# EasyEDA Pro project ExtBoard-001_2024-04-03.epro, board PCB-ExtBoard-001
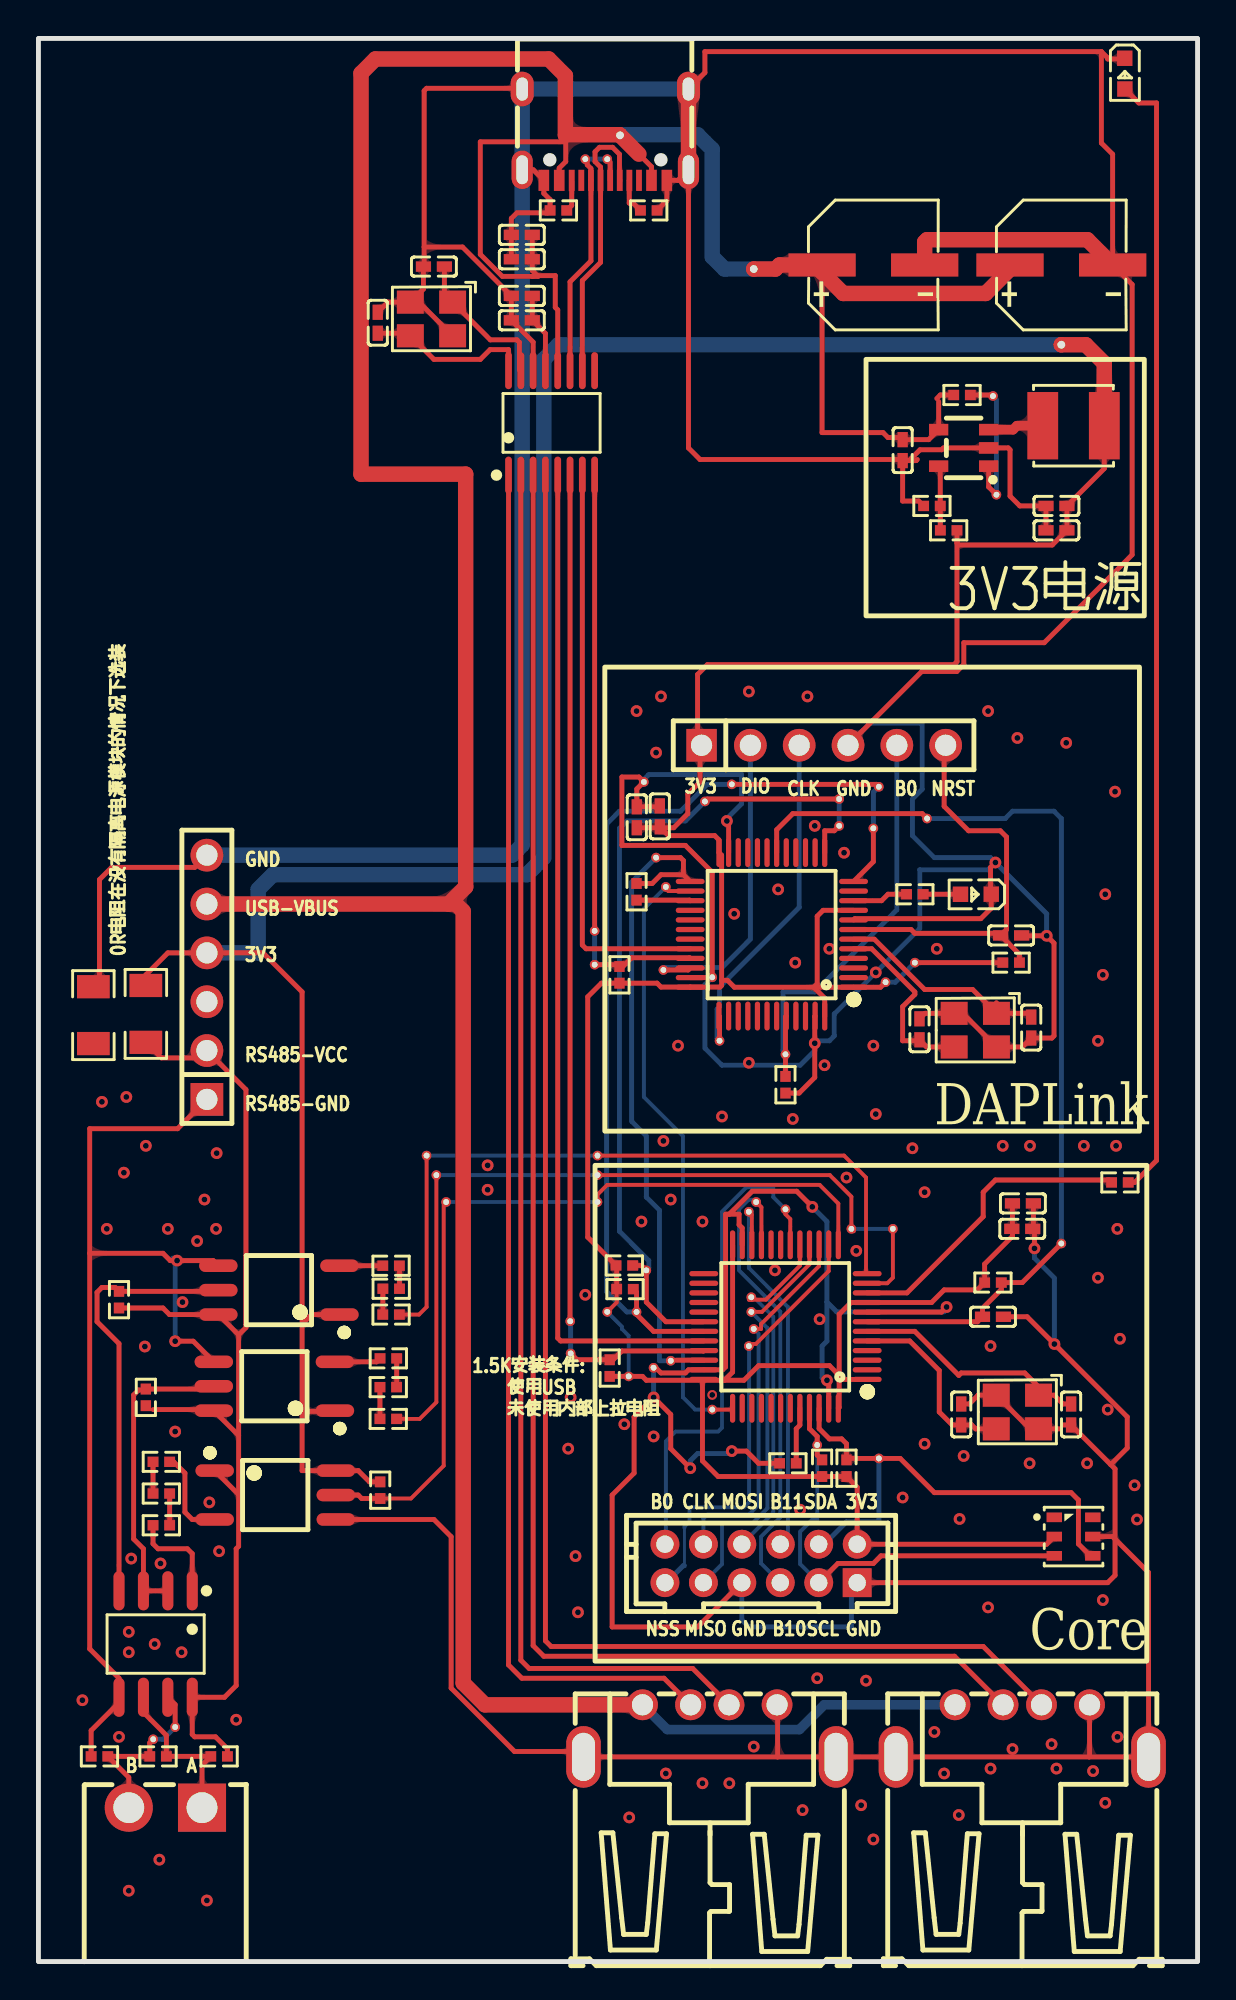
[diagram p5: board, top side]
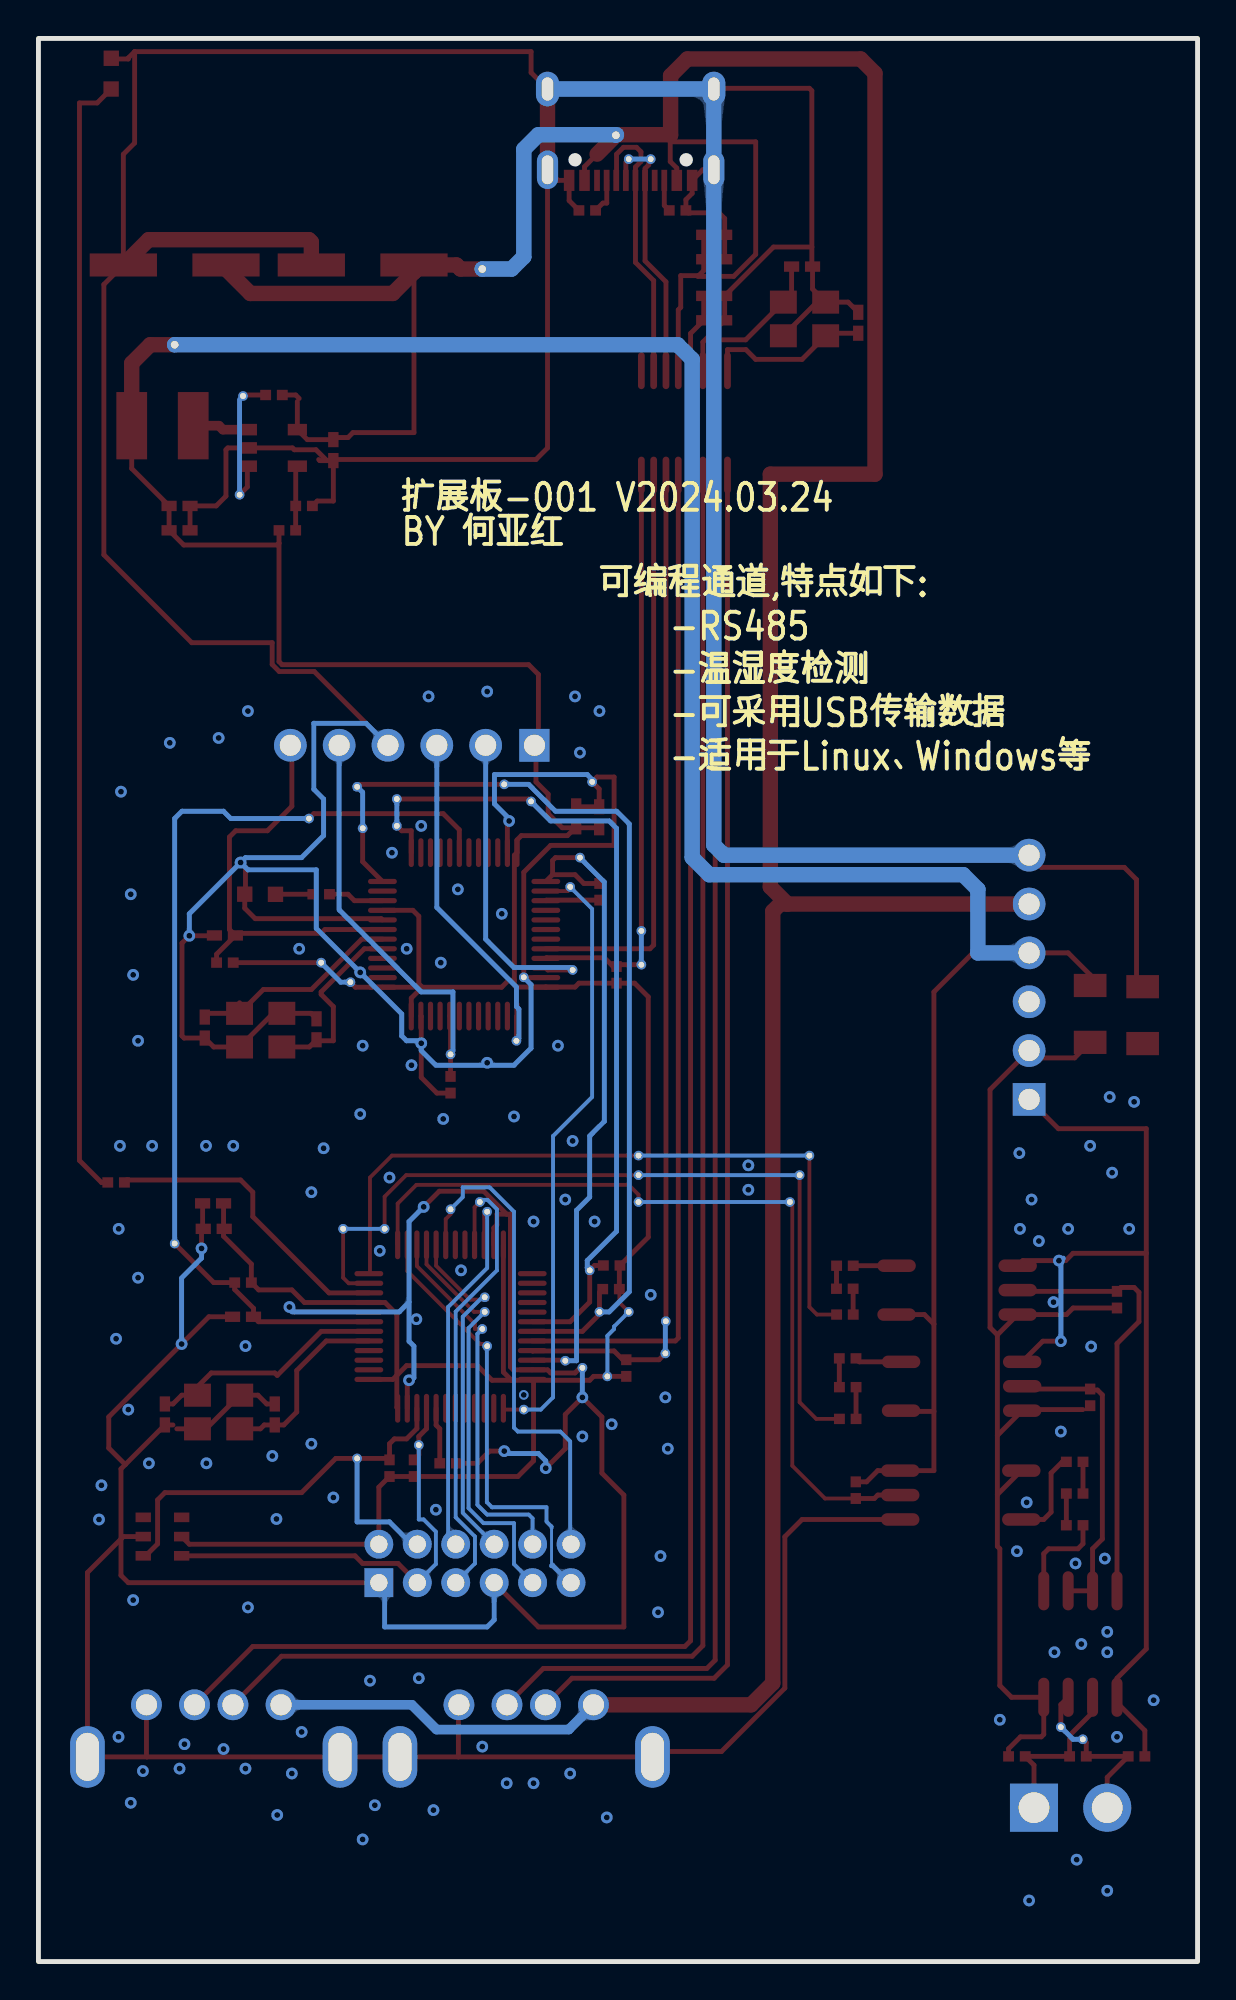
[diagram p6: board, bottom side, seen from below]

Outline 60.3 x 100 mm; copper layers: Top Layer, Bottom Layer. Coordinates in mm from the lower left corner of the outline.
Outline path: rectangle 0,100 60.3,0
Stack: Top Layer 0.035mm / Dielectric1 1.51mm FR4 er 4.5 / Bottom Layer 0.035mm

## Design rules (mm)
net DM4: USB4
net DP4: USB4
net DM3: USB3
net DP3: USB3
net DM2: USB2
net DP2: USB2
net DM1: USB1
net DP1: USB1
net DP-UP: USB-UP
net DM-UP: USB-UP
template: 自定义配置
spacing copperThickness1oz (default): track to track 0.102, other pairs 0.102 to 0.3
spacing copperThickness2oz: track to track 0.203, other pairs 0.152 to 0.3
track width copperThickness1oz (default): min 0.127, default 0.254, max 2.54
track width copperThickness2oz: min 0.203, default 0.254, max 2.54
track width VBUS: min 0.254, default 0.4, max 2.54
differential pair differentialPair (default): width min 0.127, default 0.254, max 2.54; gap min 0.152, default 0.152
via viaSize (default): diameter min 0.5, default 0.61, max 10; hole min 0.3, default 0.305, max 6.3
net USB-VBUS uses VBUS

## Placement (name value [footprint] x y rotation side)
C1  10uF  [C0402]  51.18 38.1 180 top
C2  100nF  [C0402]  51.22 39.42 180 top
C3  100nF  [C0402]  25.15 85.34 0 top
C4  10uF  [C0402]  25.15 86.61 0 top
C5  10uF  [C0402]  25.15 89.79 0 top
C6  100nF  [C0402]  25.15 88.52 0 top
C7  20pF  [C0402]  17.65 85.22 270 top
C8  20pF  [C0402]  20.57 88.14 180 top
C9  12pF  [C0402]  48.01 28.45 270 top
C10  12pF  [C0402]  53.72 28.45 90 top
C11  100nF  [C0402]  49.66 33.53 180 top
C15  10uF  [C0402]  44.96 78.59 90 top
C16  10uF  [C0402]  52.96 75.69 0 top
C17  100nF  [C0402]  52.96 74.42 0 top
C22  100uF  [CAP-SMD_BD6.3-L6.6-W6.6-FD]  53.21 88.22 0 top
C23  100uF  [CAP-SMD_BD6.3-L6.6-W6.6-FD]  43.43 88.22 0 top
C24  100nF  [C0402]  50.6 53.36 180 top
C25  12pF  [C0402]  45.83 48.48 270 top
C26  12pF  [C0402]  51.65 48.57 90 top
C30  10uF  [C0402]  31.13 59.5 270 top
C31  100nF  [C0402]  32.32 59.55 270 top
CN1  DB2ERC-3.81-2P-GN  [CONN-TH_2P-P3.81_DB2ERC-3.81-2P]  6.6 8 0 top
CN2  顶板接口  [CONN-TH_12P-P2.00_HCTL_HC-PHD]  37.59 20.7 0 top
H1  PZ254-1-06-Z-8.5  [HDR-TH_06P-P2.54-V-M]  40.85 63.25 0 top
H2  PZ254V-11-06P  [HDR-TH_6P-P2.54-V-M]  8.76 51.18 90 top
L1  4.7uH  [IND-SMD_L4.0-W4.0]  53.85 79.86 0 top
LED1  NCD0603R1  [LED0603-RD_RED]  48.77 55.5 180 top
LED2  Run LED  [LED0603-RD_RED]  56.52 98.17 270 top
NOREF  -  [Pad_e43]  27.66 33.3 0 top
NOREF#2  -  [Pad_e875]  53.21 37.34 0 top
NOREF#3  -  [Pad_e1357]  36.96 38.99 0 top
NOREF#4  -  [Pad_e12496]  28.93 51.84 0 top
NOREF#5  -  [Pad_e570]  44.07 50.93 0 top
NOREF#6  -  [Pad_e888]  46.23 59.44 0 top
NOREF#7  -  [Pad_e569]  45.59 51.94 0 top
NOREF#8  -  [Pad_e1147]  20.19 41.91 0 top
NOREF#9  -  [Pad_e607]  5.97 11.56 0 top
NOREF#10  -  [Pad_e12577]  49.84 76.27 0 top
NOREF#11  -  [Pad_e12503]  53.21 84.07 0 top
NOREF#12  -  [Pad_e1473]  37.08 33.78 0 top
NOREF#13  -  [Pad_e12494]  29.59 93.73 0 top
NOREF#14  -  [Pad_e1303]  35.05 28.7 0 top
NOREF#15  -  [Pad_e1075]  43.72 26.16 0 top
NOREF#16  -  [Pad_e12495]  28.93 53.59 0 top
NOREF#17  -  [Pad_e506]  32.51 51.56 0 top
NOREF#18  -  [Pad_e1158]  29.08 41.91 0 top
NOREF#19  -  [Pad_e1472]  37.08 34.54 0 top
NOREF#20  -  [Pad_e1088]  40.51 26.86 0 top
NOREF#21  -  [Pad_e918]  41.66 60.45 0 top
NOREF#22  -  [Pad_e1154]  21.21 39.5 0 top
NOREF#23  -  [Pad_e919]  43.72 61.09 0 top
NOREF#24  -  [Pad_e1236]  32.64 55.88 0 top
NOREF#25  -  [Pad_e896]  41.66 59.06 0 top
NOREF#26  -  [Pad_e1739]  32 30.88 0 top
NOREF#27  -  [Pad_e1904]  35.05 51.18 0 top
NOREF#28  -  [Pad_e941]  36.07 61.21 0 top
NOREF#29  -  [Pad_e507]  35.43 47.88 0 top
NOREF#30  -  [Pad_e1637]  36.96 32 0 top
NOREF#31  -  [Pad_e1221]  42.29 38.1 0 top
NOREF#32  -  [Pad_e908]  43.43 58.93 0 top
NOREF#33  -  [Pad_e508]  38.86 47.17 0 top
NOREF#34  -  [Pad_e1886]  31.5 61.34 0 top
NOREF#35  -  [Pad_e12492]  28.45 93.73 0 top
NOREF#36  -  [Pad_e1474]  37.21 32.89 0 top
NOREF#37  -  [Pad_e954]  31.62 35.94 0 top
NOREF#38  -  [Pad_e12500]  30.26 94.96 0 top
NOREF#39  -  [Pad_e1378]  37.34 39.5 0 top
NOREF#40  -  [Pad_e1153]  20.7 40.89 0 top
NOREF#41  -  [Pad_e1160]  29.08 39.5 0 top
NOREF#42  -  [Pad_e1266]  32.13 57.4 0 top
NOREF#43  -  [Pad_e1410]  38.86 39.12 0 top
NOREF#44  -  [Pad_e12501]  37.21 88.01 0 top
NOREF#45  -  [Pad_e608]  7.11 12.19 0 top
NOREF#46  -  [Pad_e1225]  44.45 38.1 0 top
NOREF#47  -  [Pad_e49]  27.69 31.62 0 top
NOREF#48  -  [Pad_e1292]  32.89 31.24 0 top
NOREF#49  -  [Pad_e1159]  29.08 40.89 0 top
NOREF#50  -  [Pad_e12570]  49.66 81.41 0 top
NOREF#51  -  [Pad_e1313]  30.7 30.43 0 top
NOREF#52  -  [Pad_e942]  34.67 60.33 0 top
NOREF#53  -  [Pad_e1323]  29.59 33.78 0 top
NOREF#54  -  [Pad_e969]  31.11 33.78 0 top
R1  5.1kΩ  [R0402]  27.05 91.06 180 top
R2  5.1kΩ  [R0402]  31.75 91.06 0 top
R3  10kΩ  [R0402]  38.99 25.91 180 top
R4  10kΩ  [R0402]  50.6 51.94 180 top
R6  1.5kΩ  [R0402]  29.72 30.86 270 top
R7  10kΩ  [R0402]  30.51 34.97 0 top
R8  10kΩ  [R0402]  30.48 36.2 0 top
R11  1kΩ  [R0402]  48.05 81.46 180 top
R12  68kΩ  [R0402]  47.35 74.42 180 top
R13  15kΩ  [R0402]  46.48 75.69 180 top
R14  10kΩ  [R0402]  38.86 45.59 270 top
R15  1.5kΩ  [R0402]  30.23 51.31 270 top
R16  100Ω  [R0402]  31.11 55.63 270 top
R17  5.1kΩ  [R0402]  45.59 55.5 180 top
R18  5.1kΩ  [R0402]  56.26 40.51 180 top
R19  1.5kΩ  [R0402]  6.22 10.67 0 top
R20  10kΩ  [R0402]  9.4 10.67 0 top
R21  10kΩ  [R0402]  3.18 10.67 0 top
R22  1.5kΩ  [R0402]  5.59 29.34 270 top
R23  1.5kΩ  [R0402]  4.19 34.42 270 top
R24  1.5kΩ  [R0402]  17.78 24.51 270 top
R25  100Ω  [R0402]  6.39 25.99 0 top
R26  100Ω  [R0402]  6.39 24.34 0 top
R27  100Ω  [R0402]  6.39 22.69 0 top
R28  100Ω  [R0402]  18.35 33.64 0 top
R29  100Ω  [R0402]  18.35 34.99 0 top
R30  100Ω  [R0402]  18.35 36.18 0 top
R31  100Ω  [R0402]  18.2 28.22 0 top
R32  100Ω  [R0402]  18.2 29.87 0 top
R33  100Ω  [R0402]  18.2 31.36 0 top
R34  0Ω  [R1206]  2.86 49.21 90 top
R35  0Ω  [R1206]  5.59 49.28 270 top
R36  68kΩ  [R0402]  49.66 35.31 180 top
R37  10kΩ  [R0402]  40.77 25.65 270 top
R38  10kΩ  [R0402]  42.04 25.65 270 top
U1  CH334R  [QSOP-16_L4.9-W3.9-P0.64-LS6.0-BL]  26.69 80.01 0 top
U2  AIR32F103CCT6-LQFP48  [LQFP-48_L7.0-W7.0-P0.50-LS9.0-BL]  38.86 33.02 90 top
U3  SY8089AAAC  [SOT-23-5_L3.0-W1.7-P0.95-LS2.8-BR]  48.13 78.71 0 top
U4  AIR32F103CCT6-LQFP48  [LQFP-48_L7.0-W7.0-P0.50-LS9.0-BL]  38.15 53.41 90 top
U5  MAX3485ESA  [SOP-8_L5.0-W4.0-P1.27-LS6.0-BL]  6.1 16.51 180 top
U6  MPCM601(T1)-GV  [SOP-5-L4.4-W3.6-P1.27-LS7.0-TL]  12.27 29.92 180 top
U7  MPCM601(T1)-GV  [SOP-5-L4.4-W3.6-P1.27-LS7.0-TL]  12.51 34.91 180 top
U8  MPCM601(T1)-GV  [SOP-5-L4.4-W3.6-P1.27-LS7.0-TL]  12.32 24.26 0 top
U9  AHT20  [SENSOR-SMD_L3.0-W3.0-P1.00-BR]  53.85 22.1 180 top
USB1  TYPE-C 16PIN 2MD(073)  [USB-C-SMD_TYPE-C-6PIN-2MD-073]  29.49 95 180 top
USB2  U-USBAR04P-F002  [USB-A-TH_USB-302-T]  34.92 12 0 top
USB3  U-USBAR04P-F002  [USB-A-TH_USB-302-T]  51.18 12 0 top
X1  12MHz  [OSC-SMD_4P-L3.2-W2.5-BL]  20.45 85.41 180 top
X2  8MHz  [OSC-SMD_4P-L3.2-W2.5-BL]  48.74 48.43 180 top
X3  8MHz  [OSC-SMD_4P-L3.2-W2.5-BL]  50.93 28.58 180 top

## Footprints (pads in the part's own frame, mm; a bottom-side part is the same pattern mirrored in y, then rotated)
C0402
  rect 0.79x0.54 smd: 1(-0.545,0) 2(0.545,0)
CAP-SMD_BD6.3-L6.6-W6.6-FD
  rect 3.5x1.2 smd: 1(-2.67,0) 2(2.67,0)
CONN-TH_2P-P3.81_DB2ERC-3.81-2P
  rect 2.5x2.5 hole 1.6: 1(1.905,0)
  round 2.5 hole 1.6: 2(-1.905,0)
CONN-TH_12P-P2.00_HCTL_HC-PHD
  rect 1.5x1.5 hole 0.9: 1(5,-1)
  round 1.5 hole 0.9: 2(5,1) 3(3,-1) 4(3,1) 5(1,-1) 6(1,1) 7(-1,-1) 8(-1,1) 9(-3,-1) 10(-3,1) 11(-5,-1) 12(-5,1)
HDR-TH_06P-P2.54-V-M
  rect 1.575x1.7 hole 1.1: 1(-6.35,0)
  round 1.7 hole 1.1: 2(-3.81,0) 3(-1.27,0) 4(1.27,0) 5(3.81,0) 6(6.35,0)
HDR-TH_6P-P2.54-V-M
  rect 1.7x1.7 hole 1.1: 1(-6.35,0)
  round 1.7 hole 1.1: 2(-3.81,0) 3(-1.27,0) 4(1.27,0) 5(3.81,0) 6(6.35,0)
IND-SMD_L4.0-W4.0
  rect 1.6x3.5 smd: 1(-1.6,0) 2(1.6,0)
LED0603-RD_RED
  rect 0.8x0.8 smd: 1(-0.799,-0.004) 2(0.799,0.004)
LQFP-48_L7.0-W7.0-P0.50-LS9.0-BL
  oval 0.27x1.5 smd: 1(-2.75,-4.25) 2(-2.25,-4.25) 3(-1.75,-4.25) 4(-1.25,-4.25) 5(-0.75,-4.25) 6(-0.25,-4.25) 7(0.25,-4.25) 8(0.75,-4.25) 9(1.25,-4.25) 10(1.75,-4.25) 11(2.25,-4.25) 12(2.75,-4.25) 25(2.75,4.25) 26(2.25,4.25) 27(1.75,4.25) 28(1.25,4.25) 29(0.75,4.25) 30(0.25,4.25) 31(-0.25,4.25) 32(-0.75,4.25) 33(-1.25,4.25) 34(-1.75,4.25) 35(-2.25,4.25) 36(-2.75,4.25)
  oval 1.5x0.27 smd: 13(4.25,-2.75) 14(4.25,-2.25) 15(4.25,-1.75) 16(4.25,-1.25) 17(4.25,-0.75) 18(4.25,-0.25) 19(4.25,0.25) 20(4.25,0.75) 21(4.25,1.25) 22(4.25,1.75) 23(4.25,2.25) 24(4.25,2.75) 37(-4.25,2.75) 38(-4.25,2.25) 39(-4.25,1.75) 40(-4.25,1.25) 41(-4.25,0.75) 42(-4.25,0.25) 43(-4.25,-0.25) 44(-4.25,-0.75) 45(-4.25,-1.25) 46(-4.25,-1.75) 47(-4.25,-2.25) 48(-4.25,-2.75)
OSC-SMD_4P-L3.2-W2.5-BL
  rect 1.4x1.2 smd: 1(-1.1,-0.875) 2(1.1,-0.875) 3(1.1,0.875) 4(-1.1,0.875)
Pad_e43
  round 0.5 hole 0.305: 49(0,0)
Pad_e49
  round 0.5 hole 0.305: 49(0,0)
Pad_e506
  round 0.5 hole 0.305: 51(0,0)
Pad_e507
  round 0.5 hole 0.305: 53(0,0)
Pad_e508
  round 0.5 hole 0.305: 54(0,0)
Pad_e569
  round 0.5 hole 0.305: 55(0,0)
Pad_e570
  round 0.5 hole 0.305: 56(0,0)
Pad_e607
  round 0.5 hole 0.305: 57(0,0)
Pad_e608
  round 0.5 hole 0.305: 58(0,0)
Pad_e875
  round 0.5 hole 0.305: 59(0,0)
Pad_e888
  round 0.5 hole 0.305: 60(0,0)
Pad_e896
  round 0.5 hole 0.305: 60(0,0)
Pad_e908
  round 0.5 hole 0.305: 61(0,0)
Pad_e918
  round 0.5 hole 0.305: 62(0,0)
Pad_e919
  round 0.5 hole 0.305: 63(0,0)
Pad_e941
  round 0.5 hole 0.305: 64(0,0)
Pad_e942
  round 0.5 hole 0.305: 65(0,0)
Pad_e954
  round 0.5 hole 0.305: 66(0,0)
Pad_e969
  round 0.5 hole 0.305: 67(0,0)
Pad_e1075
  round 0.5 hole 0.305: 70(0,0)
Pad_e1088
  round 0.5 hole 0.305: 71(0,0)
Pad_e1147
  round 0.5 hole 0.305: 72(0,0)
Pad_e1153
  round 0.5 hole 0.305: 73(0,0)
Pad_e1154
  round 0.5 hole 0.305: 74(0,0)
Pad_e1158
  round 0.5 hole 0.305: 75(0,0)
Pad_e1159
  round 0.5 hole 0.305: 76(0,0)
Pad_e1160
  round 0.5 hole 0.305: 77(0,0)
Pad_e1221
  round 0.5 hole 0.305: 78(0,0)
Pad_e1225
  round 0.5 hole 0.305: 79(0,0)
Pad_e1236
  round 0.5 hole 0.305: 80(0,0)
Pad_e1266
  round 0.5 hole 0.305: 81(0,0)
Pad_e1292
  round 0.5 hole 0.305: 82(0,0)
Pad_e1303
  round 0.5 hole 0.305: 83(0,0)
Pad_e1313
  round 0.5 hole 0.305: 84(0,0)
Pad_e1323
  round 0.5 hole 0.305: 85(0,0)
Pad_e1357
  round 0.5 hole 0.305: 86(0,0)
Pad_e1378
  round 0.5 hole 0.305: 87(0,0)
Pad_e1410
  round 0.5 hole 0.305: 88(0,0)
Pad_e1472
  round 0.5 hole 0.305: 89(0,0)
Pad_e1473
  round 0.5 hole 0.305: 90(0,0)
Pad_e1474
  round 0.5 hole 0.305: 91(0,0)
Pad_e1637
  round 0.5 hole 0.305: 92(0,0)
Pad_e1739
  round 0.5 hole 0.305: 93(0,0)
Pad_e1886
  round 0.5 hole 0.305: 94(0,0)
Pad_e1904
  round 0.5 hole 0.305: 95(0,0)
Pad_e12492
  round 0.5 hole 0.305: 49(0,0)
Pad_e12494
  round 0.5 hole 0.305: 49(0,0)
Pad_e12495
  round 0.5 hole 0.305: 49(0,0)
Pad_e12496
  round 0.5 hole 0.305: 49(0,0)
Pad_e12500
  round 0.8 hole 0.4: 50(0,0)
Pad_e12501
  round 0.8 hole 0.4: 52(0,0)
Pad_e12503
  round 0.8 hole 0.4: 52(0,0)
Pad_e12570
  round 0.5 hole 0.305: 49(0,0)
Pad_e12577
  round 0.5 hole 0.305: 49(0,0)
QSOP-16_L4.9-W3.9-P0.64-LS6.0-BL
  oval 0.35x1.921 smd: 1(-2.24,-2.716) 2(-1.6,-2.716) 3(-0.96,-2.716) 4(-0.32,-2.716) 5(0.32,-2.716) 6(0.96,-2.716) 7(1.6,-2.716) 8(2.24,-2.716) 9(2.24,2.716) 10(1.6,2.716) 11(0.96,2.716) 12(0.32,2.716) 13(-0.32,2.716) 14(-0.96,2.716) 15(-1.6,2.716) 16(-2.24,2.716)
R0402
  rect 0.566x0.54 smd: 1(-0.433,0) 2(0.433,0)
R1206
  rect 1.208x1.701 smd: 1(-1.479,0) 2(1.479,0)
SENSOR-SMD_L3.0-W3.0-P1.00-BR
  rect 0.8x0.5 smd: 1(1,-1) 2(1,0) 3(1,1) 4(-1,1) 5(-1,0) 6(-1,-1)
SOP-5-L4.4-W3.6-P1.27-LS7.0-TL
  oval 2x0.65 smd: 1(-3.15,1.27) 2(-3.15,-1.27) 3(3.15,-1.27) 4(3.15,0) 5(3.15,1.27)
SOP-8_L5.0-W4.0-P1.27-LS6.0-BL
  oval 0.574x2.035 smd: 1(-1.905,-2.768) 2(-0.635,-2.768) 3(0.635,-2.768) 4(1.905,-2.768) 5(1.905,2.768) 6(0.635,2.768) 7(-0.635,2.768) 8(-1.905,2.768)
SOT-23-5_L3.0-W1.7-P0.95-LS2.8-BR
  rect 1x0.6 smd: 1(1.3,-0.95) 2(1.3,0) 3(1.3,0.95) 4(-1.3,0.95) 5(-1.3,-0.95)
USB-A-TH_USB-302-T
  round 1.6 hole 1.1: 1(-3.5,1.355) 2(-1,1.355) 3(1,1.355) 4(3.5,1.355)
  oval 1.8x3.2 hole 1.2x2.5: 5(-6.57,-1.355) 6(6.57,-1.355)
USB-C-SMD_TYPE-C-6PIN-2MD-073
  rect 0.55x1.1 smd: 1(-3.2,2.375) 2(-2.4,2.375) 11(2.4,2.375) 12(3.2,2.375)
  rect 0.3x1.1 smd: 3(-1.75,2.375) 4(-1.25,2.375) 5(-0.75,2.375) 6(-0.25,2.375) 7(0.25,2.375) 8(0.75,2.375) 9(1.25,2.375) 10(1.75,2.375)
  oval 1.1x2 hole 0.6x1.5: 13(-4.325,1.825) 14(4.325,1.825)
  oval 1.2x1.8 hole 0.6x1.2: 13(-4.325,-2.375) 14(4.325,-2.375)

## Nets
3V3: C1.2 C2.2 C16.2 C17.2 C30.2 C31.2 CN2.2 H1.1 H2.4 L1.2 NOREF#5.56 NOREF#7.55 NOREF#11.52 NOREF#51.84 NOREF#53.85 R4.2 R6.2 R7.1 R8.1 R12.1 R15.2 R24.1 R35.1 R36.2 R37.2 R38.2 U2.1 U2.9 U2.24 U2.36 U2.48 U4.1 U4.9 U4.24 U4.36 U4.48 U6.1 U7.1 U8.5 U9.2
GND: C1.1 C2.1 C3.1 C4.1 C5.1 C6.1 C7.1 C8.2 C9.1 C10.1 C11.1 C15.1 C16.1 C17.1 C22.2 C23.2 C24.1 C25.1 C26.1 C30.1 C31.1 CN2.1 CN2.7 H1.4 H2.6 LED1.1 LED2.1 NOREF#26.93 NOREF#27.95 NOREF#34.94 R1.2 R2.2 R3.2 R13.2 R14.2 R34.2 U1.14 U2.8 U2.23 U2.35 U2.47 U3.2 U4.8 U4.23 U4.35 U4.47 U8.3 U9.5 USB1.1 USB1.12 USB1.13 USB1.14 USB2.4 USB2.5 USB2.6 USB3.4 USB3.5 USB3.6 X1.2 X1.4 X2.2 X2.4 X3.2 X3.4
DAP-CDC: U4.21
DAP-DTR: U4.31
DAP-HID: U4.20
DAP-MSC: U4.22
DAP-NRST: C11.2 NOREF#2.59 NOREF#6.60 R36.1 U2.7 U4.18
DAP-RTS: U4.30
DAP-RUN: R17.2 U4.10
DAP-RX: NOREF#21.62 NOREF#25.60 NOREF#37.66 NOREF#52.65 R8.2 U2.30 U4.13
DAP-SWCLK: NOREF#14.83 NOREF#24.80 U2.37 U4.26
DAP-SWDIO: NOREF#42.81 NOREF#48.82 R16.1 U2.34 U4.25
DAP-TX: NOREF#23.63 NOREF#28.64 NOREF#32.61 NOREF#54.67 R7.2 U2.31 U4.12
DAPLINK-B0: H1.5 NOREF#33.54 R14.1 U4.44
DAPLINK-NRST: C24.2 H1.6 R4.1 U4.7
DAPLINK-SWCLK: H1.3 NOREF#29.53 U4.37
DAPLINK-SWDIO: H1.2 NOREF#17.51 U4.34
DM1: U1.7 U4.32
DM2: U1.5 U2.32
DM3: U1.3 USB3.2
DM4: U1.1 USB2.2
DM-UP: U1.10 USB1.5 USB1.7
DP1: NOREF#4.49 NOREF#16.49 R15.1 U1.8 U4.33
DP2: NOREF.49 NOREF#47.49 R6.1 U1.6 U2.33
DP3: U1.4 USB3.3
DP4: U1.2 USB2.3
DP-UP: NOREF#13.49 NOREF#35.49 U1.11 USB1.6 USB1.8
I2C-SCL: CN2.3 NOREF#20.71 R37.1 U2.45 U9.3
I2C-SDA: CN2.4 NOREF#15.70 R38.1 U2.46 U9.4
PB0: CN2.12 NOREF#43.88 U2.18
PB10: CN2.5 NOREF#39.87 U2.21
PB11: CN2.6 NOREF#3.86 U2.22
RS485-A: CN1.1 R19.2 R20.1 U5.6
RS485-B: CN1.2 NOREF#9.57 NOREF#45.58 R19.1 R21.2 U5.7
RS485-DE_RE: R22.1 U5.2 U5.3 U6.4
RS485-DI: R23.1 U5.4 U7.4
RS485-GND: H2.1 R21.1 R34.1 U5.5 U6.3 U7.3
RS485-RO: R27.1 U5.1
RS485-VCC: H2.2 R20.2 R22.2 R23.2 R35.2 U5.8 U6.5 U7.5 U8.1
SPI-CLK: CN2.10 NOREF#36.91 U2.15
SPI-MISO: CN2.9 NOREF#12.90 U2.16
SPI-MOSI: CN2.8 NOREF#19.89 U2.17
SPI-NSS: CN2.11 NOREF#30.92 U2.14
UART-RTS: NOREF#31.78 NOREF#40.73 NOREF#46.79 NOREF#49.76 R31.2 U2.11
UART-RX: NOREF#22.74 NOREF#41.77 R24.2 U2.13 U8.4
UART-TX: NOREF#8.72 NOREF#18.75 R28.2 U2.12
USB-VBUS: C5.2 C6.2 C15.2 C22.1 C23.1 H2.5 NOREF#38.50 NOREF#44.52 R11.2 U1.12 U3.4 USB1.2 USB1.11 USB2.1 USB3.1
$1N253: C3.2 C4.2 U1.13
$1N699: C7.2 U1.16 X1.3
$1N932: R1.1 USB1.10
$1N933: R2.1 USB1.4
$1N978: C8.1 U1.15 X1.1
$2N755: L1.1 U3.3
$2N758: NOREF#10.49 NOREF#50.49 R11.1 U3.1
$2N763: R12.2 R13.1 U3.5
$3N854: C26.2 U4.6 X2.1
$3N1016: C25.2 U4.5 X2.3
$3N1490: R16.2 U4.27
$3N1914: LED1.2 R17.1
$4N336: C10.2 U2.6 X3.1
$4N370: C9.2 U2.5 X3.3
$4N637: R3.1 U2.44
$4N993: LED2.2 R18.1
$4N1000: R18.2 U2.10
$5N963: R25.2 U8.2
$5N966: R25.1 R26.1
$5N1012: R26.2 R27.2
$5N1138: R28.1 R29.1
$5N1140: R29.2 R30.2
$5N1150: R30.1 U7.2
$5N1267: R31.1 R32.1
$5N1269: R32.2 R33.2
$5N1278: R33.1 U6.2

Pads without a net: H2 3; U1 9; U2 2 3 4 19 20 25 26 27 28 29 38 39 40 41 42 43; U4 2 3 4 11 14 15 16 17 19 28 29 38 39 40 41 42 43 45 46; U9 1 6; USB1 3 9

## Via types
v1: diameter 0.61, hole 0.305, Top Layer to Bottom Layer, 127 vias
v2: diameter 0.5, hole 0.305, Top Layer to Bottom Layer, 1 via

## Routing (per net, layer and track width the routed paths; a pad name or vN(x,y) marks a point on that pad's centre or on a via; arc(x,y) is an arc through that point)
3V3: length 294.8
  Top Layer w0.2: R7.1 30.08,34.27 NOREF#53.85
  Top Layer w0.254: 41.66,30.48 41.87,30.27 U2.1 ; 41.66,30.48 41.66,33.66 42.27,34.27 U2.9 46.46,34.27 47.12,34.93 48.84,34.93 R36.2 49.22,36.27 50.67,37.72 50.67,38.06 C1.2 50.67,38.13 C2.2 ; 41.66,30.48 41.15,30.99 37.47,30.99 36.7,30.23 35.69,30.23 ; 41.66,30.48 41.66,28.81 U2.48 ; 40.34,50.66 40.9,50.1 U4.48 ; 40.34,50.66 U4.1 43.81,50.66 NOREF#5.56 ; 40.34,50.66 36.2,50.66 35.84,51.03 35.54,51.03 ; 40.34,50.66 40.51,50.84 40.51,54.36 40.82,54.66 U4.9 ; 13.72,33.15 14.21,33.64 U7.1 ; 13.72,33.15 13.72,50.42 11.68,52.45 H2.4 6.73,52.45 5.59,51.31 R35.1 ; 13.72,33.15 13.72,28.61 ; 13.72,28.61 15.39,28.61 U6.1 ; 13.72,28.61 13.72,25.53 U8.5 16.64,25.53 17.22,24.94 R24.1 ; 34.57,30.23 34.54,30.2 34.54,26.03 35.36,25.22 R37.2 R38.2 42.59,24.67 CN2.2 52.45,21.7 U9.2 ; 34.57,30.23 U2.36 34.66,30.23 35.69,30.23 ; 34.57,30.23 31.62,30.23 31.42,30.43 NOREF#51.84 R6.2 ; 35.54,51.03 35.54,57.53 U4.24 35.4,58.32 35.18,58.55 32.78,58.55 32.37,58.96 ; 35.54,51.03 35.54,50.76 35.46,50.67 33.91,50.67 U4.36 33.9,50.67 32.39,50.67 32.18,50.88 R15.2 29.29,50.88 28.58,50.17 28.58,37.67 R8.1 30.08,36.16 R7.1 ; 47.79,73.75 47.88,73.66 52.74,73.66 C17.2 C16.2 55.45,77.64 L1.2 ; 47.79,73.75 47.79,67.6 47.63,67.44 34.8,67.44 34.29,66.93 34.29,63.45 H1.1 34.42,63.17 34.42,61.34 33.78,60.71 33.78,59.69 33.05,58.96 32.37,58.96 ; 47.79,73.75 R12.1 ; 35.69,30.23 36.11,30.65 U2.24 ; 32.28,58.96 32.37,58.96 ; 32.28,58.96 C30.2 ; 32.28,58.96 C31.2 ; NOREF#7.55 R4.2
  Top Layer w0.8: NOREF#11.52 54.48,84.07 55.45,83.11 L1.2
  Bottom Layer w0.2: NOREF#51.84 30.7,32.54 30.35,32.89 30.35,33.02 NOREF#53.85
  Bottom Layer w0.254: NOREF#7.55 44.58,50.93 NOREF#5.56
  Bottom Layer w0.8: NOREF#11.52 27.05,84.07 26.29,83.31 26.29,57.4 25.4,56.52 12.19,56.52 11.43,55.75 11.43,52.45 H2.4
GND: length 553.1
  Top Layer w0.254: U4.23 35.9,59.09 35.81,59.18 v1(35.81,59.31) ; 49.4,78.74 U3.2 ; U3.2 50.45,78.71 50.55,78.61 50.55,76.2 51.05,75.69 C16.1 C17.1 ; U3.2 47.08,78.71 46.99,78.61 45.86,78.61 45.3,78.05 ; 45.3,78.05 45.66,78.05 45.72,78.11 ; 45.3,78.05 C15.1 ; v1(49.78,57.15) 49.53,56.9 49.53,55.54 LED1.1 49.57,54.77 49.02,54.23 42.47,54.23 U4.8 ; C2.1 51.76,38.13 C1.1 51.82,38.01 v1(51.82,37.08) ; CN2.7 34.29,17.4 29.85,17.4 29.85,24.26 30.99,25.4 30.99,28.32 v1(32,29.34) 32.89,28.45 32.89,26.67 v1(33.91,25.65) ; C24.1 51.16,53.34 v1(52.45,53.34) 52.83,52.96 52.83,48.13 52.72,48.02 C26.1 51.18,47.56 X2.4 48.09,49.31 X2.2 46.12,49.31 C25.1 ; X1.2 18.18,86.29 C7.1 ; X1.2 20.03,86.97 C8.2 20.07,88.18 20.07,89.15 ; X1.2 19.8,86.29 X1.4 ; 35.94,38.86 36.45,38.86 36.45,38.31 36.61,38.15 U2.23 ; 35.94,38.86 37.14,40.06 39.45,40.06 v1(40.26,39.24) ; 35.94,38.86 35.75,38.86 35.75,30.92 35.6,30.77 U2.35 33.82,30.77 33.66,30.61 32.39,30.61 32.12,30.88 NOREF#26.93 ; 53.3,27.9 C10.1 55.78,25.84 ; C11.1 51.44,33.53 v1(52.85,32.11) 56.64,28.32 56.64,26.7 55.78,25.84 ; R3.2 37.47,25.91 36.83,26.54 v1(36.07,26.54) ; USB1.13 34.67,98.23 34.67,99.31 55.3,99.31 55.3,94.56 55.88,93.98 C22.2 56.9,87.21 56.9,73.15 52.32,68.58 48.14,68.58 48.14,67.45 47.77,67.08 45.95,67.08 H1.4 ; C15.1 44.9,78.11 34.42,78.11 33.82,78.71 USB1.13 33.27,92.62 USB1.1 32.69,91.57 R2.2 ; C15.1 44.96,75.95 45.8,75.95 46.05,75.69 ; 54.66,10.64 USB3.6 57.75,20.23 56.01,21.97 ; 54.66,10.64 54.68,10.66 USB3.4 ; 54.66,10.64 USB3.5 USB2.6 38.45,10.64 ; 55.78,25.84 56.01,25.62 56.01,21.97 ; v1(41.02,30.23) 41.11,30.14 U2.47 ; 56.01,21.97 56.01,20.08 55.63,19.7 CN2.1 ; 56.01,21.97 55.88,22.1 U9.5 ; 38.45,10.64 USB2.5 28.07,10.92 24.77,10.92 21.47,14.22 21.47,22.09 20.57,22.99 U8.3 ; 38.45,10.64 38.45,13.32 USB2.4 ; 20.07,89.15 20.07,97.28 20.19,97.41 25.13,97.41 USB1.14 ; 20.07,89.15 22.06,89.15 C4.1 C3.1 25.73,84.21 U1.14 ; C31.1 32.28,60.05 C30.1 31.13,60.97 NOREF#34.94 31.24,61.6 30.35,61.6 30.35,58.04 33.66,58.04 35.05,56.64 NOREF#27.95 35.04,51.16 U4.35 ; 48.01,28.99 48.42,28.99 48.88,29.45 X3.2 51.58,27.7 X3.4 53.1,27.7 ; USB1.14 25.74,93.17 USB1.12 26.29,91.94 26.62,91.62 R1.2 26.49,90.93 24.89,90.93 24.6,90.64 C5.1 C6.1 ; 55.3,99.31 55.63,98.99 55.63,98.93 56.47,98.93 LED2.1 ; R34.2 3.18,51.01 3.18,56.26 3.81,56.9 8.13,56.9 H2.6 ; R14.2 39.57,45.16 40.39,45.97 v1(40.39,47.75) 40.39,49.15 U4.47 ; v1(47.24,34.04) 46.98,33.77 U2.8
  Top Layer w0.8: C22.2 54.57,89.54 46.23,89.54 46.1,89.41 C23.2 ; USB1.13 USB1.13
  Bottom Layer w0.254: 41.02,34.29 41.02,32.26 40.77,32 40.77,30.35 40.89,30.23 v1(41.02,30.23) ; 41.02,34.29 41.02,38.48 v1(40.26,39.24) ; 41.02,34.29 41.53,33.78 47.12,33.78 ; v1(36.07,26.54) 35.94,26.42 34.29,26.42 33.91,26.03 v1(33.91,25.65) ; CN2.7 36.59,17.76 36.96,17.4 42.29,17.4 42.29,19.4 CN2.1 ; 40.39,47.88 41.15,47.88 41.4,48.13 41.4,49.28 v1(43.56,51.44) 45.85,53.72 45.85,56.77 49.4,56.77 v1(49.78,57.15) ; v1(49.78,57.15) 52.45,54.48 52.45,53.47 ; v1(49.78,57.15) 49.53,57.4 46.61,57.4 45.47,58.55 45.47,60.45 45.97,60.96 45.97,64.39 43.26,64.39 H1.4 ; v1(52.85,32.11) 52.85,35.54 51.82,36.58 v1(51.82,37.08) ; NOREF#26.93 32,30.87 v1(32,29.34) ; v1(40.39,47.75) 40.39,47.37 39.62,46.61 35.56,46.61 34.67,47.49 34.67,50.8 NOREF#27.95 ; v1(35.81,59.31) 35.81,59.44 36.58,60.2 36.58,61.72 31.75,61.72 31.5,61.47
  Bottom Layer w0.8: 25.17,58.06 24.64,57.53 H2.6 ; 25.17,58.06 USB1.14 USB1.14 USB1.13
  vias: v1(23.37,41.4) v1(23.37,40.13) v1(27.56,26.67) v1(27.69,29.34) v1(27.94,21.08) v1(28.07,18.16) v1(28.45,34.67) v1(30.48,27.94) v1(30.73,7.49) v1(31.11,65.02) v1(31.37,38.48) v1(32,27.31) v1(32.13,62.87) v1(32.39,65.79) v1(32.51,42.67) v1(32.64,9.78) v1(32.89,39.62) v1(33.27,47.63) v1(34.54,38.48) v1(34.54,9.27) v1(35.56,43.94) v1(35.94,9.27) v1(36.2,54.48) v1(36.96,66.04) v1(36.96,46.74) v1(37.21,11.18) v1(38.32,35.94) v1(38.48,55.75) v1(39.24,43.82) v1(39.37,51.94) v1(39.62,23.5) v1(39.75,7.87) v1(40.01,65.79) v1(40.39,59.06) v1(40.51,14.73) v1(40.64,33.4) v1(40.89,46.61) v1(41.14,52.66) v1(41.91,57.66) v1(42.04,40.77) v1(42.55,36.96) v1(42.8,8.13) v1(43.05,14.61) v1(43.43,47.63) v1(43.43,6.35) v1(43.56,44.07) v1(44.96,24.13) v1(45.47,42.29) v1(46.1,40.01) v1(46.1,26.92) v1(46.61,11.94) v1(46.73,52.66) v1(47.12,9.78) v1(47.92,23.01) v1(47.88,7.62) v1(48.13,26.29) v1(49.4,65.02) v1(49.4,18.42) v1(49.53,32) v1(49.53,10.03) v1(50.17,42.42) v1(50.67,11.05) v1(50.93,63.63) v1(51.58,42.42) v1(51.56,25.91) v1(52.7,11.3) v1(52.96,10.03) v1(53.47,63.37) v1(54.39,42.42) v1(54.55,25.91) v1(54.86,9.91) v1(55.12,47.88) v1(55.12,35.56) v1(55.37,51.31) v1(55.37,18.8) v1(55.5,55.5) v1(55.5,8.25) v1(55.63,28.7) v1(56.01,60.83) v1(56.06,42.42) v1(56.13,38.1) v1(56.13,11.68) v1(56.26,32.39) v1(57.02,24.77) v1(57.15,22.99) v2(35.05,29.46)
DAP-NRST: length 50.9
  Top Layer w0.254: U4.18 38.4,58.85 39.24,59.69 45.97,59.69 NOREF#6.60 ; 53.09,37.21 51.18,35.31 R36.1 50.09,34.95 49.11,33.97 C11.2 48.85,33.27 U2.7
  Bottom Layer w0.254: NOREF#6.60 50.29,59.44 50.67,59.82 52.83,59.82 53.21,59.44 NOREF#2.59
DAP-RUN: length 2.9
  Top Layer w0.254: U4.10 43.86,55.16 44.2,55.5 R17.2
DAP-RX: length 45
  Top Layer w0.254: U2.30 32.64,33.27 31.62,34.29 NOREF#37.66 31.37,36.2 R8.2 ; NOREF#21.62 34.8,60.45 NOREF#52.65 ; U4.13 40.9,58.8 41.4,58.8 NOREF#25.60
  Bottom Layer w0.254: NOREF#52.65 33.66,59.31 30.61,59.31 30.23,58.93 30.23,37.97 31.75,36.45 31.75,36.07 NOREF#37.66 ; NOREF#25.60 NOREF#21.62
DAP-SWCLK: length 32.1
  Top Layer w0.2: U4.26 32.77,55.66 32.77,55.75 NOREF#24.80 ; U2.37 36.04,28.7 NOREF#14.83
  Bottom Layer w0.2: NOREF#24.80 31.5,54.74 31.5,44.96 33.53,42.93 33.53,29.34 34.16,28.7 NOREF#14.83
DAP-SWDIO: length 34.8
  Top Layer w0.254: NOREF#42.81 33.4,57.4 33.55,57.25 33.55,56.52 ; R16.1 31.93,56.06 32.39,56.52 33.55,56.52 ; 33.17,31.27 U2.34 ; 33.55,56.52 U4.25
  Bottom Layer w0.254: 33.02,31.24 32.31,31.24 32.31,39.07 31.62,39.75 31.62,42.93 30.86,43.69 30.86,56.13 NOREF#42.81
DAP-TX: length 52.2
  Top Layer w0.254: NOREF#32.61 43.43,57.19 U4.12 ; R7.2 31.11,34.8 31.11,33.66 32,32.77 U2.31 ; NOREF#28.64 43.59,61.21 NOREF#23.63
  Bottom Layer w0.254: NOREF#54.67 30.61,33.78 29.56,34.83 29.56,59.15 30.23,59.82 33.4,59.82 34.8,61.21 NOREF#28.64 ; NOREF#32.61 43.43,60.8 NOREF#23.63 43.82,60.99
DAPLINK-B0: length 22.6
  Top Layer w0.254: R14.1 NOREF#33.54 38.86,49.12 U4.44
  Bottom Layer w0.254: 38.86,47.24 38.73,47.37 38.73,50.42 40.39,50.42 44.66,54.69 H1.5
DAPLINK-NRST: length 22
  Top Layer w0.254: C24.2 50.36,53.67 50.36,58.48 50.04,58.8 48.39,58.8 47.12,60.07 47.12,63.17 H1.6 ; C24.2 51.03,52.38 51.03,51.94 ; C24.2 49.95,53.47 45.59,53.47 45.4,53.66 U4.7
DAPLINK-SWCLK: length 18.5
  Top Layer w0.254: U4.37 35.43,49.14 NOREF#29.53
  Bottom Layer w0.254: NOREF#29.53 35.31,48.01 35.31,49.53 35.43,49.66 35.43,50.67 39.58,54.82 H1.3
DAPLINK-SWDIO: length 16.7
  Top Layer w0.254: U4.34 33.8,51.56 NOREF#17.51
  Bottom Layer w0.254: H1.2 37.04,53.17 35.56,51.69 32.64,51.69 NOREF#17.51
DM1: length 30.1
  Top Layer w0.254: U4.32 28.49,52.66 28.29,52.86 U1.7
DM2: length 52.5
  Top Layer w0.254: U2.32 27.17,32.27 27.01,32.42 U1.5
DM3: length 86.6
  Top Layer w0.254: USB3.2 47.66,15.88 26.29,15.88 25.73,16.43 U1.3
DM4: length 72.2
  Top Layer w0.254: U1.1 24.45,15.42 25.15,14.73 32.54,14.73 USB2.2
DM-UP: length 14.8
  Top Layer w0.254: 30.24,92.62 30.23,92.64 30.23,93.98 29.87,94.34 29.19,94.34 28.96,94.11 28.96,93.6 29.24,93.31 USB1.7 29.24,88.36 28.29,87.41 U1.10
DP1: length 30.7
  Top Layer w0.254: NOREF#16.49 U1.8 ; NOREF#4.49 30.13,51.84 R15.1 30.41,51.74 30.86,52.2 33.87,52.2 U4.33
  Bottom Layer w0.254: NOREF#16.49 NOREF#4.49 ; 28.94,51.84 28.96,51.82
DP2: length 53.1
  Top Layer w0.254: NOREF#47.49 28.02,31.29 R6.1 ; 29.9,31.29 30.35,31.75 34.59,31.75 ; 29.9,31.29 R6.1 ; 29.9,31.29 R6.1 ; 34.59,31.75 U2.33 34.59,31.75 ; 27.65,33.31 U1.6
  Bottom Layer w0.254: NOREF#47.49 27.69,33.27
DP3: length 87.8
  Top Layer w0.254: USB3.3 49.15,16.38 26.67,16.38 26.37,16.68 U1.4
DP4: length 73.4
  Top Layer w0.254: USB2.3 34.04,15.24 25.53,15.24 25.09,15.67 U1.2
DP-UP: length 13.6
  Top Layer w0.254: 29.74,93.58 USB1.6 ; U1.11 27.65,87.34 28.74,88.43 USB1.8 28.74,93.24 28.55,93.43 28.55,93.73
  Bottom Layer w0.254: NOREF#35.49 NOREF#13.49
I2C-SCL: length 23.9
  Top Layer w0.254: U9.3 43.83,21.1 43.43,20.7 41.59,20.7 CN2.3 ; R37.1 40.51,26.34 NOREF#20.71 40.51,27.31 40.11,27.71 U2.45
  Bottom Layer w0.2: NOREF#20.71 40.51,22.99 40.26,22.99 39.62,22.35 39.62,20.67 CN2.3
I2C-SDA: length 26.8
  Top Layer w0.254: U2.46 40.61,27.71 41.15,27.18 41.78,27.18 42.04,26.92 R38.1 42.11,26.16 NOREF#15.70 44.83,26.16 46.61,24.38 53.72,24.38 54.1,24 54.1,21.72 54.72,21.1 U9.4
  Bottom Layer w0.254: CN2.4 40.88,21.7 42.04,22.86 43.72,22.86 NOREF#15.70
PB0: length 26.4
  Top Layer w0.2: U2.18 39.11,38.61 38.86,38.86 NOREF#43.88
  Bottom Layer w0.2: CN2.12 32.64,21.75 32.64,27.05 33.15,27.56 35.36,27.56 35.56,27.76 35.56,38.99 36.83,40.26 38.23,40.26 38.23,39.75 NOREF#43.88
PB10: length 24.4
  Top Layer w0.2: U2.21 37.61,39.22 37.47,39.37
  Bottom Layer w0.2: CN2.5 37.59,20.7 37.59,22.1 38.59,23.1 38.59,33.8 36.45,35.94 36.45,39.12 36.94,39.61 37.22,39.61 NOREF#39.87
PB11: length 20
  Top Layer w0.2: NOREF#3.86 37.11,38.83 U2.22
  Bottom Layer w0.2: 36.96,38.86 36.96,36.07 38.99,34.04 38.99,22.1 CN2.6
RS485-A: length 8.7
  Top Layer w0.254: CN1.1 8.51,10.21 R20.1 R19.2 6.66,11.76 5.46,12.95 U5.6
RS485-B: length 9.4
  Top Layer w0.254: CN1.2 4.7,9.58 R21.2 R19.1 5.79,11.38 NOREF#9.57 ; U5.7 7.11,13.36 NOREF#45.58
  Bottom Layer w0.254: NOREF#45.58 6.48,11.56 NOREF#9.57
RS485-DE_RE: length 16
  Top Layer w0.254: U5.2 U5.3 5.46,21.46 4.95,21.97 4.95,29.46 5.21,29.72 5.54,29.72 R22.1 8.98,29.77 U6.4
RS485-DI: length 22.5
  Top Layer w0.254: U7.4 9.3,34.85 R23.1 3.99,35.05 3.3,35.05 3.05,34.8 3.05,33.27 4.19,32.13 U5.4
RS485-GND: length 54.4
  Top Layer w0.254: R21.1 2.74,12.01 4.19,13.46 U5.5 4.19,14.73 2.67,16.26 2.67,36.83 ; U7.3 9.09,36.45 v1(7.21,36.45) 6.86,36.45 6.48,36.83 2.67,36.83 ; 2.67,36.83 2.67,43.31 7.24,43.31 8.76,44.83 ; v1(7.11,32.26) 8.05,32.26 U6.3
  Bottom Layer w0.254: 6.98,36.58 7.11,36.45 v1(7.11,32.26)
  vias: v1(2.29,13.59) v1(3.3,44.7) v1(3.56,38.1) v1(4.19,11.68) v1(4.45,41.02) v1(4.57,44.96) v1(4.7,17.15) v1(4.7,16.08) v1(4.7,3.68) v1(4.83,20.96) v1(5.54,31.98) v1(5.59,42.42) v1(6.05,16.51) v1(6.29,5.3) v1(6.35,20.7) v1(6.73,38.1) v1(7.11,27.56) v1(7.49,34.29) v1(7.45,16.08) v1(8.26,37.47) v1(8.64,39.62) v1(8.76,3.18) v1(8.89,23.88) v1(9.24,38.1) v1(9.27,42.04) v1(9.4,21.34) v1(10.29,12.57)
RS485-RO: length 5.1
  Top Layer w0.254: R27.1 5.96,21.73 6.22,21.46 7.75,21.46 8,21.21 U5.1
RS485-VCC: length 58.3
  Top Layer w0.254: R35.2 6.4,46.99 8.38,46.99 H2.2 10.8,45.34 10.8,32.97 10.41,32.59 ; 10.41,24.28 U8.1 ; 10.41,24.28 10.41,21.59 10.29,21.46 10.29,14.35 9.68,13.74 U5.8 8,11.81 8.13,11.68 9.21,11.68 9.83,11.06 R20.2 ; 10.41,24.28 10.41,27.35 ; 5.97,28.7 9.07,28.7 U6.5 10.41,27.35 ; 10.41,27.35 10.41,32.59 ; R23.2 6.48,33.98 6.82,33.64 U7.5 10.41,32.59
SPI-CLK: length 19.9
  Top Layer w0.2: U2.15 40.61,36.17 37.59,33.15 37.59,32.89 NOREF#36.91
  Bottom Layer w0.2: 37.21,33.02 NOREF#36.91 37.47,32.64 37.47,23.75 36.96,23.24 34.79,23.24 34.59,23.04 CN2.10
SPI-MISO: length 21.9
  Top Layer w0.2: NOREF#12.90 37.64,33.78 40.11,36.26 U2.16
  Bottom Layer w0.2: 37.21,33.78 NOREF#12.90 37.92,32.94 37.92,23.57 37.15,22.8 35.56,22.8 35.56,20.67 CN2.9
SPI-MOSI: length 18.6
  Top Layer w0.2: NOREF#19.89 36.96,34.42 37.85,34.42 39.61,36.18 U2.17
  Bottom Layer w0.2: CN2.8 38.23,23.34 38.23,33.53 37.21,34.54
SPI-NSS: length 23
  Top Layer w0.2: U2.14 41.11,35.91 37.32,32.12 37.2,32.12 36.96,31.88
  Bottom Layer w0.15: 33.61,20.58 33.61,22.55
  Bottom Layer w0.2: 33.61,22.55 33.61,22.62 33.87,22.88 33.87,23.62 36.7,23.62 36.97,23.89 36.97,31.95
  Bottom Layer w0.254: 33.61,20.58 33.54,20.58 32.61,19.65
UART-RTS: length 44.3
  Top Layer w0.2: R31.2 19.84,28.22 20.7,29.08 NOREF#40.73 ; NOREF#46.79 44.45,35.56 44.16,35.27 U2.11 ; NOREF#49.76 41.17,40.89 42.29,39.77 NOREF#31.78 42.42,37.97
  Bottom Layer w0.2: NOREF#49.76 NOREF#40.73 ; NOREF#31.78 NOREF#46.79
UART-RX: length 43.6
  Top Layer w0.2: NOREF#41.77 29.08,39.88 29.59,40.39 40.64,40.39 41.61,39.41 U2.13 ; R24.2 19.38,24.08 21.08,25.78 21.08,39.5
  Top Layer w0.254: R24.2 16.82,24.08 16.64,24.26 U8.4
  Bottom Layer w0.2: NOREF#41.77 NOREF#22.74
UART-TX: length 37.8
  Top Layer w0.2: NOREF#8.72 20.19,34.04 19.8,33.64 R28.2 ; U2.12 43.05,35.83 43.05,40.77 41.91,41.91 NOREF#18.75
  Bottom Layer w0.2: NOREF#18.75 NOREF#8.72
USB-VBUS: length 220.4
  Top Layer w0.254: 25.95,87.67 25.99,87.63 25.69,87.63 ; 25.95,87.67 25.69,87.93 25.69,89.79 25.65,89.75 ; 25.95,87.67 25.69,87.63 ; 46.83,81.12 U3.4 46.31,79.14 C15.2 ; 27.3,94.87 27.41,94.98 27.43,94.96 27.43,93.6 27.09,93.26 USB1.11 ; C15.2 44.85,79.25 44.2,79.25 43.94,79.51 40.76,79.51 40.76,87.84 ; C15.2 44.94,79.12 ; 31.24,93.99 31.89,93.33 USB1.2 ; U1.12 27.01,85.89 26.89,86.02 26.89,87.67 26.03,87.67 ; 46.74,81.28 46.92,81.46 R11.2 47.56,81.41 ; 25.69,87.63 24.13,87.63 22.99,88.77 22.99,94.62 27.3,94.62 ; 27.05,82.76 27.02,82.73
  Top Layer w0.8: NOREF#44.52 38.34,88.01 38.55,88.22 40.38,88.22 ; 31.24,93.99 30.23,95 27.43,95 27.41,94.98 27.41,98.06 26.54,98.93 17.53,98.93 16.78,98.19 16.78,77.34 22.23,77.34 22.23,55.88 21.34,54.99 ; 40.38,88.22 41.86,86.74 49.28,86.74 50.54,88.01 C22.1 ; 40.38,88.22 C23.1 ; 21.34,54.99 H2.5 ; 21.34,54.99 21.72,54.99 22.1,54.61 22.1,14.48 23.23,13.35 USB2.1
  Bottom Layer w0.5: USB3.1 40.88,13.35 39.59,12.06 32.71,12.06 USB2.1
  Bottom Layer w0.8: NOREF#44.52 35.69,88.01 35.05,88.65 35.05,94.23 34.29,95 30.23,95
$1N253: length 4.2
  Top Layer w0.254: U1.13 26.37,84.66 25.69,85.34 25.69,86.61
$1N699: length 8.7
  Top Layer w0.254: C7.2 19.21,84.67 X1.3 20.57,83.31 22.99,83.31 23.49,83.82 24.45,83.82 U1.16
$1N932: length 1.7
  Top Layer w0.254: R1.1 27.74,91.32 USB1.10
$1N933: length 1.9
  Top Layer w0.254: 31.32,91.06 30.94,91.44 30.73,91.44 30.73,92.61 USB1.4
$1N978: length 7.9
  Top Layer w0.254: U1.15 25.02,82.8 25.02,84.2 24.89,84.33 23.51,84.33 X1.1 21.12,86.72 21.12,88.14
$2N755: length 2.9
  Top Layer w0.5: U3.3 50.7,79.66 50.91,79.86 ; L1.1 50.91,79.86
$2N758: length 7.7
  Top Layer w0.254: U3.1 49.43,76.68 NOREF#10.49 ; 49.6,81.46 R11.1
  Bottom Layer w0.254: NOREF#10.49 49.84,81.23
$2N763: length 3.4
  Top Layer w0.254: 46.91,77.68 U3.5 ; R12.2 46.92,75.69 R13.1 46.92,77.67
$3N854: length 11.5
  Top Layer w0.254: U4.6 43.48,53.16 46.1,50.55 48.6,50.55 X2.1 ; X2.1 49.84,49.86 ; X2.1 51.45,49.31 C26.2
$3N1016: length 9.8
  Top Layer w0.254: U4.5 43.35,52.66 45.59,50.42 45.59,50.29 44.96,49.66 44.96,47.88 45.78,47.88 C25.2 46.21,47.56 X2.3
$3N1490: length 2.8
  Top Layer w0.254: 31.11,55.19 33.88,55.19 U4.27
$3N1914: length 1.9
  Top Layer w0.254: LED1.2 47.97,55.5 R17.1
$4N336: length 12.5
  Top Layer w0.254: 53.3,28.99 53.72,28.99 ; U2.6 45.59,32.77 47.88,30.48 48.01,30.61 51.31,30.61 52.03,29.89 X3.1 52.85,29.45 53.3,28.99
$4N370: length 9.9
  Top Layer w0.254: U2.5 45.33,32.27 46.86,30.73 46.86,28.58 47.54,27.9 C9.2 48.55,27.9 48.75,27.7 X3.3
$4N637: length 2.9
  Top Layer w0.254: R3.1 39.42,27.7 39.61,27.89 U2.44
$4N993: length 58.9
  Top Layer w0.254: R18.1 57.02,40.51 58.17,41.66 58.17,96.65 57.24,96.65 LED2.2
$4N1000: length 15.9
  Top Layer w0.254: R18.2 55.7,40.64 49.78,40.64 49.15,40.01 49.15,38.74 45.18,34.77 U2.10
$5N963: length 4.8
  Top Layer w0.254: R25.2 7.04,25.99 7.62,25.4 7.62,23.37 8,22.99 U8.2
$5N966: length 1.6
  Top Layer w0.254: R25.1 R26.1
$5N1012: length 1.6
  Top Layer w0.254: R26.2 R27.2
$5N1138: length 1.3
  Top Layer w0.254: R28.1 17.92,33.65 R29.1
$5N1140: length 1.2
  Top Layer w0.254: R30.2 18.78,36.18 R29.2
$5N1150: length 2.3
  Top Layer w0.254: U7.2 R30.1
$5N1267: length 1.7
  Top Layer w0.254: R32.1 R31.1
$5N1269: length 1.5
  Top Layer w0.254: R32.2 18.64,29.87 R33.2
$5N1278: length 2.4
  Top Layer w0.254: R33.1 17.59,31.19 15.42,31.19

## Copper pours and planes (outline as drawn; the poured copper is in the pictures)
GND on Top Layer: 16,102.36 16,77.85 22.61,77.85 22.73,77.98 22.73,13.84 27.43,13.84 27.43,-4.32 61.85,-4.32 66.8,0.64 66.8,103.12 67.31,103.63 17.27,103.63
GND on Bottom Layer: 16.13,102.87 16.13,77.98 16.26,77.85 22.35,77.85 22.61,78.11 22.61,13.84 27.56,13.84 27.56,-3.56 27.81,-3.81 63.12,-3.81 66.04,-0.89 66.04,103.51 67.06,104.52 17.78,104.52
RS485-GND on Top Layer: 0.13,48.39 11.3,48.39 11.3,-0.13 0.13,-0.13
RS485-GND on Bottom Layer: 0.45,48.39 11.3,48.39 11.3,-0.67 0.45,-0.67

Small or netless copper shapes (teardrops, artwork), in the pictures only: 423 on Top Layer, 101 on Bottom Layer

## Text on the board
Bottom Silkscreen Layer: 可编程通道,特点如下: / -RS485 / -温湿度检测 / -可采用USB传输数据 / -适用于Linux、Windows等 | BY 何亚红 | 扩展板-001 V2024.03.24
Top Silkscreen Layer: B | A | GND | USB-VBUS | 3V3 | RS485-VCC | RS485-GND | NSS | B0 | CLK | MISO | MOSI | DIO | B11 | B10 | SDA | SCL | NRST | 1.5K安装条件: / 使用USB / 未使用内部上拉电阻 | 0R电阻在没有隔离电源模块的情况下选装 | DAPLink | 3V3电源 | Core
